# Altium schematic sheet 08 - HAT.SchDoc
size 420 x 297 mm
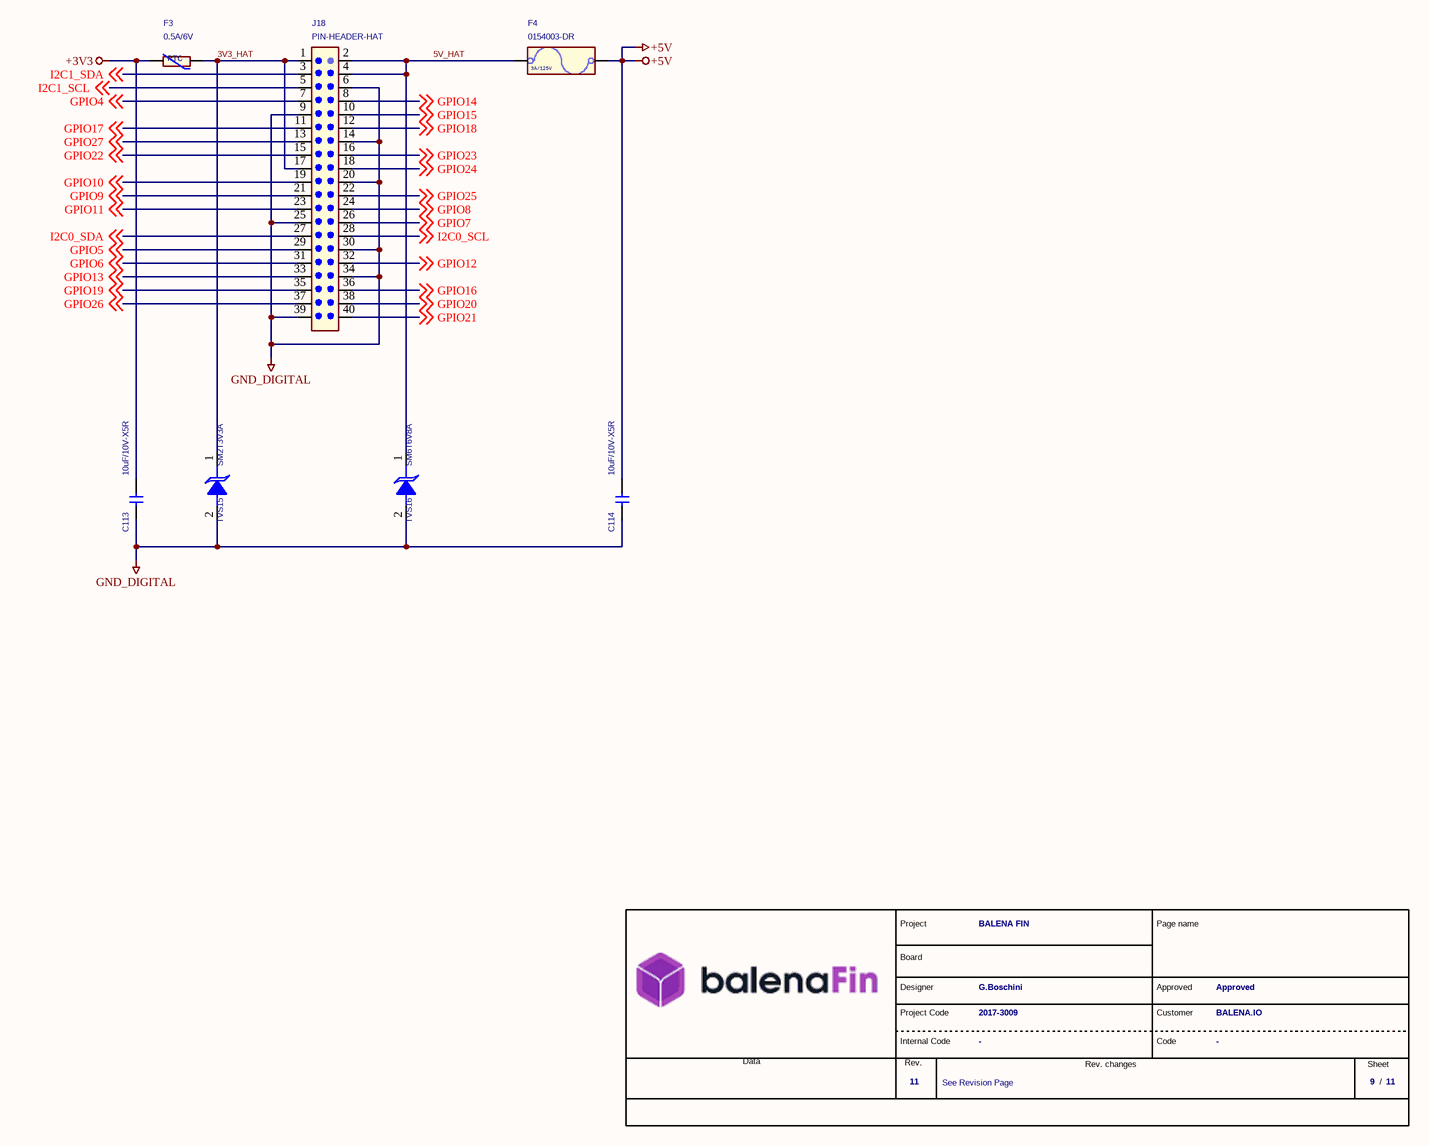
[diagram p0: 08 - HAT.SchDoc]

## Parts
*  Revision: 11  FAE RD code: 2017-3009  DocumentoRev: See Revision Page  Page Number: 9  Nome Progetto: BALENA FIN  Customer name: BALENA.IO  Project manager: Approved  Project designer: G.Boschini  (hidden comment: MyFAEVuoto)  (graphical)
C113  10uF/10V-X5R  [CS-C-0603]
C114  10uF/10V-X5R  [CS-C-0603]
F3  0.5A/6V  [FS-0603]
F4  0154003-DR  [F-LT154]
J18  PIN-HEADER-HAT  [J-20X2-0254-MDT]
TVS15  SM2T3V3A  [D-DO216AA]
TVS16  SM6T6V8A  [SMB]

## Nets
+3V3: C113.1 F3.1
+5V: C114.1 F4.2
GND_DIGITAL: C113.2 C114.2 J18.6 J18.9 J18.14 J18.20 J18.25 J18.30 J18.34 J18.39 TVS15.2(A) TVS16.2(A)
3V3_HAT: F3.2 J18.1 J18.17 TVS15.1(C)
5V_HAT: F4.1 J18.2 J18.4 TVS16.1(C)
GPIO4: J18.7 ; off-sheet GPIO4
GPIO5: J18.29 ; off-sheet GPIO5
GPIO6: J18.31 ; off-sheet GPIO6
GPIO7: J18.26 ; off-sheet GPIO7
GPIO8: J18.24 ; off-sheet GPIO8
GPIO9: J18.21 ; off-sheet GPIO9
GPIO10: J18.19 ; off-sheet GPIO10
GPIO11: J18.23 ; off-sheet GPIO11
GPIO12: J18.32 ; off-sheet GPIO12
GPIO13: J18.33 ; off-sheet GPIO13
GPIO14: J18.8 ; off-sheet GPIO14
GPIO15: J18.10 ; off-sheet GPIO15
GPIO16: J18.36 ; off-sheet GPIO16
GPIO17: J18.11 ; off-sheet GPIO17
GPIO18: J18.12 ; off-sheet GPIO18
GPIO19: J18.35 ; off-sheet GPIO19
GPIO20: J18.38 ; off-sheet GPIO20
GPIO21: J18.40 ; off-sheet GPIO21
GPIO22: J18.15 ; off-sheet GPIO22
GPIO23: J18.16 ; off-sheet GPIO23
GPIO24: J18.18 ; off-sheet GPIO24
GPIO25: J18.22 ; off-sheet GPIO25
GPIO26: J18.37 ; off-sheet GPIO26
GPIO27: J18.13 ; off-sheet GPIO27
I2C0_SCL: J18.28 ; off-sheet I2C0_SCL
I2C0_SDA: J18.27 ; off-sheet I2C0_SDA
I2C1_SCL: J18.5 ; off-sheet I2C1_SCL
I2C1_SDA: J18.3 ; off-sheet I2C1_SDA

## Notes on the sheet
- (in symbol MyFAEVuoto) Project; Page name; Board; Designer; Project Code; Customer; Internal Code; Code; Data; Rev.; Rev. changes; Sheet; /
- (in symbol PTC - MF-FSMF050X-2 -0.5A/6V) PTC
- (in symbol RAPIDO - 0154003.DR - 3A/125V) 3A/125V

## Library data of the parts
C113 C114 = CS-C-0603-10u/10V-X5R: CHIP CAP.CER. 10uF 10V 10% X5R 0603; MPN: Generic; Pkg Type: SMD; Room: CONNETTORE HAT; Mount: Yes
F3 = PTC - MF-FSMF050X-2 -0.5A/6V: PTC RESET FUSE 6V 500MA 0603; Pkg Type: SMD; Note: Ihold=500mA - Itrip=1A - Imax=40A; MPN: MF-FSMF050X-2; Mount: Yes
F4 = RAPIDO - 0154003.DR - 3A/125V: FUSE BOARD MNT 3A 125VAC/VDC SMD; Room: POWER IN; Pkg Type: SMD; MPN: 0154003-DR; Mount: Yes
J18 = STRIP-J-20X2-0254-MDT: CONN HEADER THT 40POS 2.54MM DUAL ROW RPi Color coded; MPN: PZX20180117132; Room: CONNETTORE HAT; Note: H=8.5mm; Pkg Type: THT; Mount: Yes
TVS15 = TVS-UNI - SM2T3V3A - 3.6V/200W: TVS DIODE 3.3VWM 6.8VC DO216AA; Note: Unidirectional; Pkg Type: SMD; Room: CONNETTORE HAT; MPN: SM2T3V3A; Mount: Yes
TVS16 = TVS-UNI - SM6T6V8A - 6.8V/600W: TVS DIODE 5.8VWM 13.4VC SMB; Pkg Type: SMD; Note: Unidirectional; Room: CONNETTORE HAT; MPN: SM6T6V8A; Mount: Yes
* = MyFAEVuoto: Page Count: 11; Customer Code: -; Database: -